# EAGLE design astronaut_interface2 (EAGLE 7.5.0)
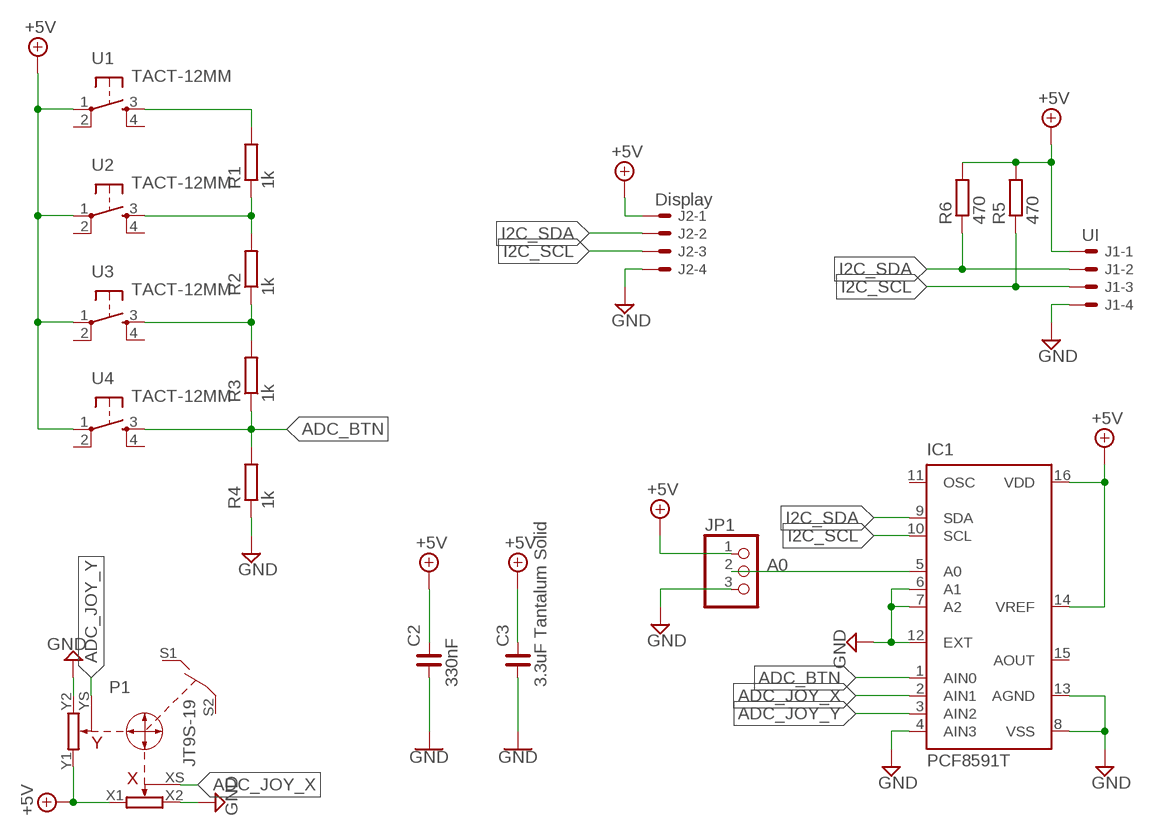
[diagram p0: schematic, sheet 1]

## Parts
C2  330nF  C_0805  [C0805]
C3  3.3uF Tantalum Solid  C_1206  [C1206]
IC1  PCF8591T  [SO16W]
J1  UI  22-05-7048-04  [7395-04]
J2  Display  22-05-7048-04  [7395-04]
JP1  PINHD-1X3  [1X03]
P1  JT9S-19  [JT9S-1P]
R1  1k  R-EU_R0805  [R0805]
R2  1k  R-EU_R0805  [R0805]
R3  1k  R-EU_R0805  [R0805]
R4  1k  R-EU_R0805  [R0805]
R5  470  R-EU_M0805  [M0805]
R6  470  R-EU_M0805  [M0805]
U1  TACT-12MM  [TACT-12_THT]
U2  TACT-12MM  [TACT-12_THT]
U3  TACT-12MM  [TACT-12_THT]
U4  TACT-12MM  [TACT-12_THT]

## Nets
+5V: C2.2 C3.2 IC1.14(VREF) IC1.16(VDD) J1.1 J2.1 JP1.1 P1.X1 P1.Y1 R5.2 R6.2 U1.1 U2.1 U3.1 U4.1
A0: IC1.5(A0) JP1.2
ADC_BTN: IC1.1(AIN0) R3.1 R4.2 U4.3
ADC_JOY_X: IC1.2(AIN1) P1.XS
ADC_JOY_Y: IC1.3(AIN2) P1.YS
GND: C2.1 C3.1 IC1.4(AIN3) IC1.6(A1) IC1.7(A2) IC1.8(VSS) IC1.12(EXT) IC1.13(AGND) J1.4 J2.4 JP1.3 P1.X2 P1.Y2 R4.1
I2C_SCL: IC1.10(SCL) J1.3 J2.3 R5.1
I2C_SDA: IC1.9(SDA) J1.2 J2.2 R6.1
N$4: R1.2 U1.3
N$6: R2.1 R3.2 U3.3
N$7: R1.1 R2.2 U2.3
Unconnected: IC1.11(OSC) IC1.15(AOUT) P1.S1 P1.S2 U1.2 U1.4 U2.2 U2.4 U3.2 U3.4 U4.2 U4.4

## Library data of the parts
C2 C3 = rc-master-smd:C_: NON-POLARIZED CAP
IC1 = micro-philips:PCF8591: I2C-Bus D/A CONVERTER; MPN: PCF8591T/2,512; OC_FARNELL: 1826767; OC_NEWARK: 70R6911
J1 J2 = EP_molex_6410_7395:22-?-04: CONNECTOR wire to board 2.54 mm (.1 inch) pitch header
JP1 = pinhead:PINHD-1X3: PIN HEADER
P1 = jt9s-1p:JT9S-19: Joystick Potentiometer 10k
R1-R4 = rcl:R-EU_: RESISTOR, European symbol
R5 R6 = resistor:R-EU_: RESISTOR, European symbol
U1-U4 = tact_mk:TACT-12MM

## Board
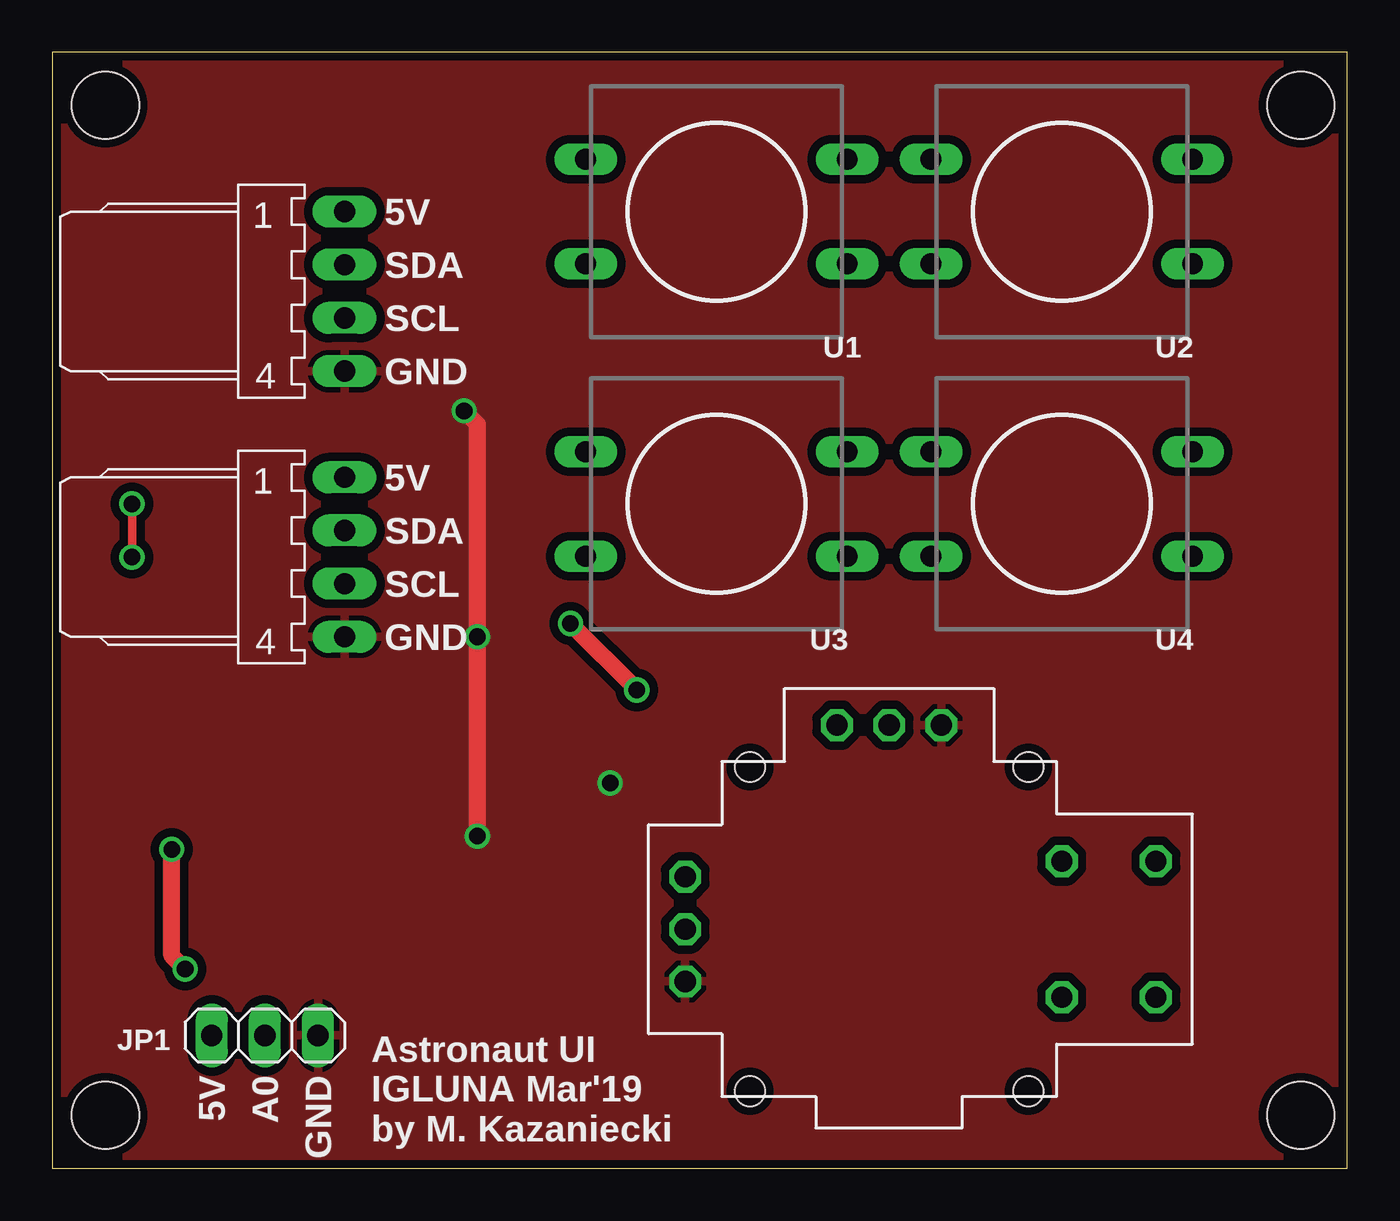
[diagram p1: board, top side]
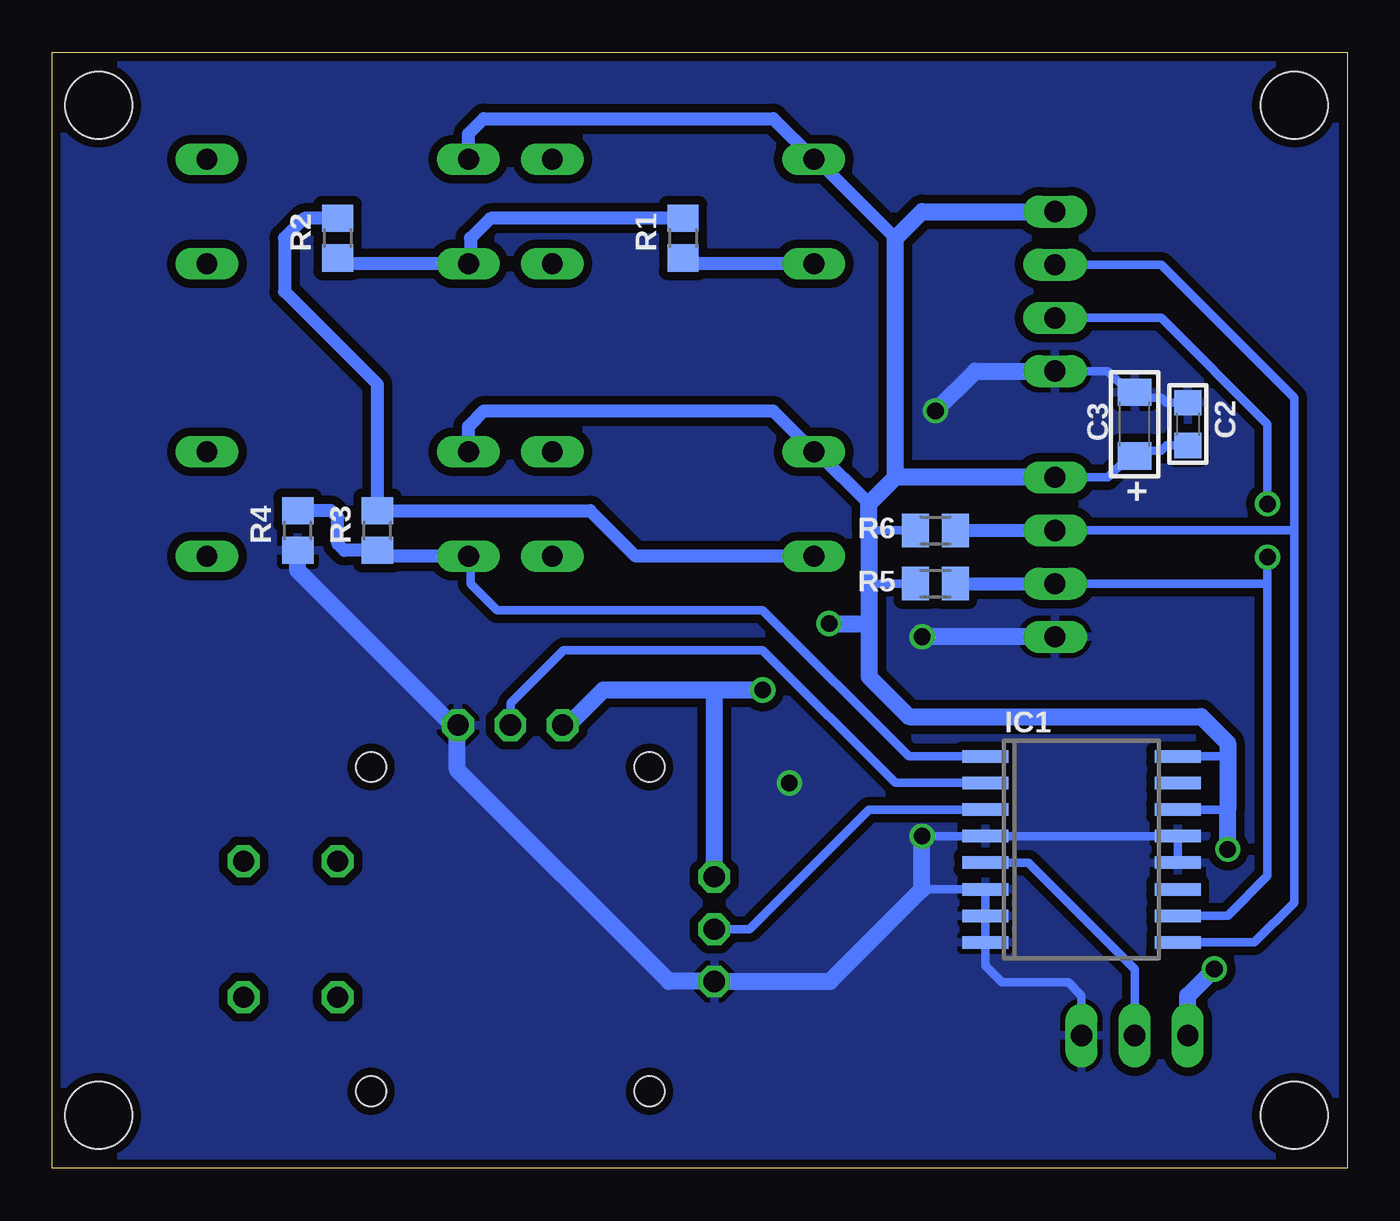
[diagram p2: board, bottom side, seen from below]

Size 61.9 x 53.33 mm. Coordinates in mm from the lower left corner, seen from the top.
Outline: 0,0 61.9,0 61.9,53.33 0,53.33 0,0
Copper layers (1*16): Top 0.035mm / dielectric 1.5mm / Bottom 0.035mm
Design rules "jlcpcb_rules": minimum track width 5mil, minimum drill 0.2mm, track to track 5mil, track to pad 5mil, pad to pad 5mil, via to via 5mil, smd to smd 5mil, copper to edge 0.2mm, drill to drill 12mil, minimum pad ring 3mil, minimum via ring 3mil, stop-mask expansion 4mil, vias tented up to drill 0mil, thermal gap 10mil
Holes 3.2 mm at 59.69,2.54 59.69,50.8 2.54,50.8 2.54,2.54

### Footprints (pad centres in the part's own frame; a part is rotated, then mirrored left to right if it is on the bottom)
C0805 = smd 1.2 x 1.3: 1 -1.016,0; 2 1.016,0
C1206 = smd 1.3 x 1.6: 1 -1.524,0; 2 1.524,0
SO16W = smd 0.6 x 2.2: 1 -4.445,-4.6; 2 -3.175,-4.6; 3 -1.905,-4.6; 4 -0.635,-4.6; 5 0.635,-4.6; 6 1.905,-4.6; 7 3.175,-4.6; 8 4.445,-4.6; 9 4.445,4.6; 10 3.175,4.6; 11 1.905,4.6; 12 0.635,4.6; 13 -0.635,4.6; 14 -1.905,4.6; 15 -3.175,4.6; 16 -4.445,4.6
7395-04 = drill 1.016 long: 1 3.81,0; 2 1.27,0; 3 -1.27,0; 4 -3.81,0
1X03 = drill 1.016 long: 1 -2.54,0; 2 0,0; 3 2.54,0
JT9S-1P = drill 1.016 octagon: S1 8.25,-3.25; S2 12.75,3.25; S3 12.75,-3.25; S4 8.25,3.25; X1 -2.5,9.75; X2 2.5,9.75; XS 0,9.75; Y1 -9.75,2.5; Y2 -9.75,-2.5; YS -9.75,0 | hole 1.422: -6.65,7.75; 6.65,7.75; 6.65,-7.75; -6.65,-7.75
R0805 = smd 1.3 x 1.5: 1 -0.95,0; 2 0.95,0
M0805 = smd 1.3 x 1.6: 1 -0.95,0; 2 0.95,0
TACT-12_THT = drill 1 long: 1 -6.25,2.5; 2 6.25,2.5; 3 -6.25,-2.5; 4 6.25,-2.5

### Placement (x,y rotation side)
C2  7.62,35.56 270 bottom
C3  10.16,35.56 270 bottom
IC1  12.7,15.24 270 bottom
J1  13.97,29.21 90 top
J2  13.97,41.91 90 top
JP1  10.16,6.35 0 top
P1  40.01,11.43 0 top
R1  31.75,44.45 270 bottom
R2  48.26,44.45 270 bottom
R3  46.36,30.48 90 bottom
R4  50.16,30.48 90 bottom
R5  19.69,27.94 180 bottom
R6  19.69,30.48 180 bottom
U1  31.75,45.72 0 top
U2  48.26,45.72 0 top
U3  31.75,31.75 0 top
U4  48.26,31.75 0 top

### Tracks (layer width: path | path; a pad name or v marks a point on that pad's centre or on a via)
+5V  (via drill 0.8)
  Top 0.813: v6.35,9.53 5.72,10.16 v5.72,15.24 | v27.94,22.86 v24.77,26.04
  Bottom 0.406: 5.72,17.14 IC1.14 | IC1.16 5.72,19.68 | R6.2 22.86,30.48 | R5.2 22.86,27.94 | 37.47,21.14 P1.X1 | C2.2 8.64,34.54 8.89,34.29 9.91,34.29 C3.2 10.54,34.29 10.54,33.91 11.43,33.02 J1.1
  Bottom 0.61: 21.59,44.45 24.77,47.62 24.77,48.26 25.46,48.26 U1.1 27.45,50.16 41.27,50.16 42.01,49.43 U2.1 | U4.1 42.01,35.46 41.27,36.2 27.45,36.2 U3.1 25.36,34.25 22.86,31.75
  Bottom 0.813: JP1.1 7.62,8.26 v6.35,9.53 | v5.72,15.24 5.72,17.14 5.72,19.68 5.72,20.32 6.99,21.59 20.96,21.59 22.86,23.5 22.86,26.04 | J1.1 21.59,33.02 | J2.1 20.32,45.72 21.59,44.45 21.59,33.02 | P1.X1 37.24,21.18 35.56,22.86 30.48,22.86 | 30.48,22.86 v27.94,22.86 | 22.86,26.04 22.86,27.94 22.86,30.48 22.86,31.75 21.59,33.02 | v24.77,26.04 22.86,26.04 | P1.Y1 30.26,22.64 30.48,22.86
A0
  Bottom 0.406: IC1.5 15.24,14.61 10.16,9.53 JP1.2
ADC_BTN
  Bottom 0.406: IC1.1 20.96,19.68 27.94,26.67 40.64,26.67 41.91,27.94 41.91,29.15
  Bottom 0.61: R4.2 48.58,31.43 48.26,31.11 48.26,29.84 47.95,29.53 R3.1 46.08,29.25 U4.3 41.91,29.15
ADC_JOY_X
  Bottom 0.406: P1.XS 40.01,22.23 37.47,24.77 27.94,24.77 21.59,18.41 IC1.2
ADC_JOY_Y
  Bottom 0.406: P1.YS 28.57,11.43 22.86,17.14 IC1.3
GND  (via drill 0.8)
  Top 0.813: v19.69,36.2 20.32,35.56 v20.32,25.4 v20.32,15.88
  Bottom 0.406: 42.55,21.14 P1.X2 42.77,21.18 | IC1.12 IC1.13 IC1.4 v20.32,15.88 | 20.32,13.34 IC1.6 IC1.7 IC1.8 17.3,9.68 16.51,8.89 13.34,8.89 12.7,8.26 JP1.3 | C2.1 8.64,36.58 8.89,36.83 9.91,36.83 C3.1 10.41,37.08 11.43,38.1 J2.4
  Bottom 0.813: 42.55,21.14 42.55,19.05 32.43,8.93 P1.Y2 24.73,8.93 20.32,13.34 v20.32,15.88 | J1.4 v20.32,25.4 | v19.69,36.2 17.78,38.1 J2.4 | 42.77,21.18 50.16,28.57 R4.1
  other vias: 26.67,18.41
  pour Bottom (isolate 0.406): 0,53.34 62.23,53.34 62.23,0 0,0
  pour Top (isolate 0.406): 0,53.34 62.23,53.34 62.23,0 0,0
I2C_SCL  (via drill 0.8)
  Top 0.406: v3.81,31.75 v3.81,29.21
  Bottom 0.406: IC1.10 5.72,12.06 3.81,13.97 3.81,27.94 | 3.81,27.94 J1.3 | J2.3 8.89,40.64 3.81,35.56 v3.81,31.75 | v3.81,29.21 3.81,27.94
  Bottom 0.61: R5.1 J1.3
I2C_SDA
  Bottom 0.406: IC1.9 4.45,10.79 2.54,12.7 2.54,30.48 | 2.54,30.48 J1.2 | J2.2 8.89,43.18 2.54,36.83 2.54,30.48
  Bottom 0.61: R6.1 J1.2
N$4
  Bottom 0.61: U1.3 31.47,43.22 R1.2
N$6
  Bottom 0.61: R2.1 49.85,45.4 50.8,44.45 50.8,41.91 46.36,37.47 R3.2 36.19,31.43 34.01,29.25 U3.3
N$7
  Bottom 0.61: R1.1 40.96,45.4 41.91,44.45 41.91,43.32 U2.3 47.98,43.22 R2.2

### Text on the board
tNames: 5V | SDA | SCL | GND | 5V | SDA | SCL | GND | 5V | A0 | GND | Astronaut UI / IGLUNA Mar'19 / by M. Kazaniecki
bNames: +